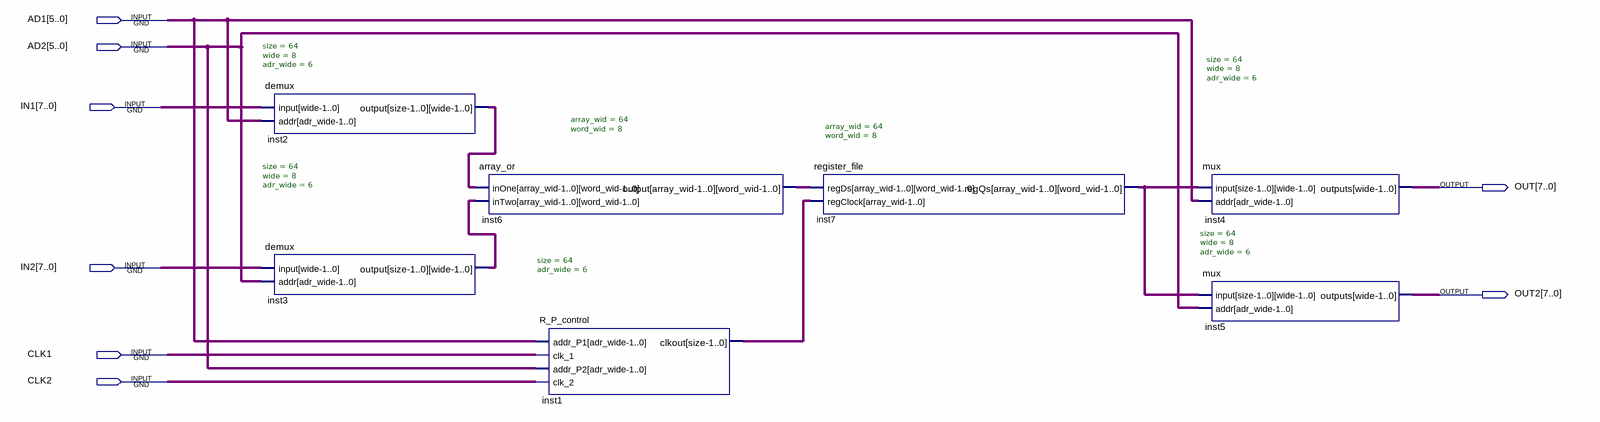
[diagram p0: schematic sheet]
// Quartus schematic r_block.bdf as structural Verilog: 7 symbols, 8 pins
module r_block (
  input  [5:0] AD1,
  input  [5:0] AD2,
  input  [7:0] IN1,
  input  [7:0] IN2,
  input  CLK1,
  input  CLK2,
  output [7:0] OUT,
  output [7:0] OUT2
);

  wire [63:0] inst1_clkout;
  wire [511:0] inst2_output, inst3_output, inst6_output, inst7_regqs;

  demux #(.size(64), .wide(8), .adr_wide(6)) inst2 (.\input (IN1), .addr(AD1), .\output (inst2_output));
  demux #(.size(64), .wide(8), .adr_wide(6)) inst3 (.\input (IN2), .addr(AD2), .\output (inst3_output));
  array_or #(.array_wid(64), .word_wid(8)) inst6 (.inOne(inst2_output), .inTwo(inst3_output), .\output (inst6_output));
  R_P_control #(.size(64), .adr_wide(6)) inst1 (
    .addr_P1(AD1), .clk_1(CLK1), .addr_P2(AD2), .clk_2(CLK2), .clkout(inst1_clkout));
  register_file #(.array_wid(64), .word_wid(8)) inst7 (
    .regDs(inst6_output), .regClock(inst1_clkout), .regQs(inst7_regqs));
  mux #(.size(64), .wide(8), .adr_wide(6)) inst4 (.\input (inst7_regqs), .addr(AD1), .outputs(OUT));
  mux #(.size(64), .wide(8), .adr_wide(6)) inst5 (.\input (inst7_regqs), .addr(AD2), .outputs(OUT2));
endmodule
